# Altium schematic sheet РД-11.04.00.SchDoc: Плата освещения
size 594 x 420 mm; ApprovedBy: Иванов; CheckedBy: Вакулин; DrawnBy: Подлесный; DocumentNumber: РД-11.04.00 Э3; SheetNumber: 1; SheetTotal: 1; Format: A2; DocumentType: Схема электрическая принципиальная; Title1str: LED передняя; ImagePath: РД-11.00.00
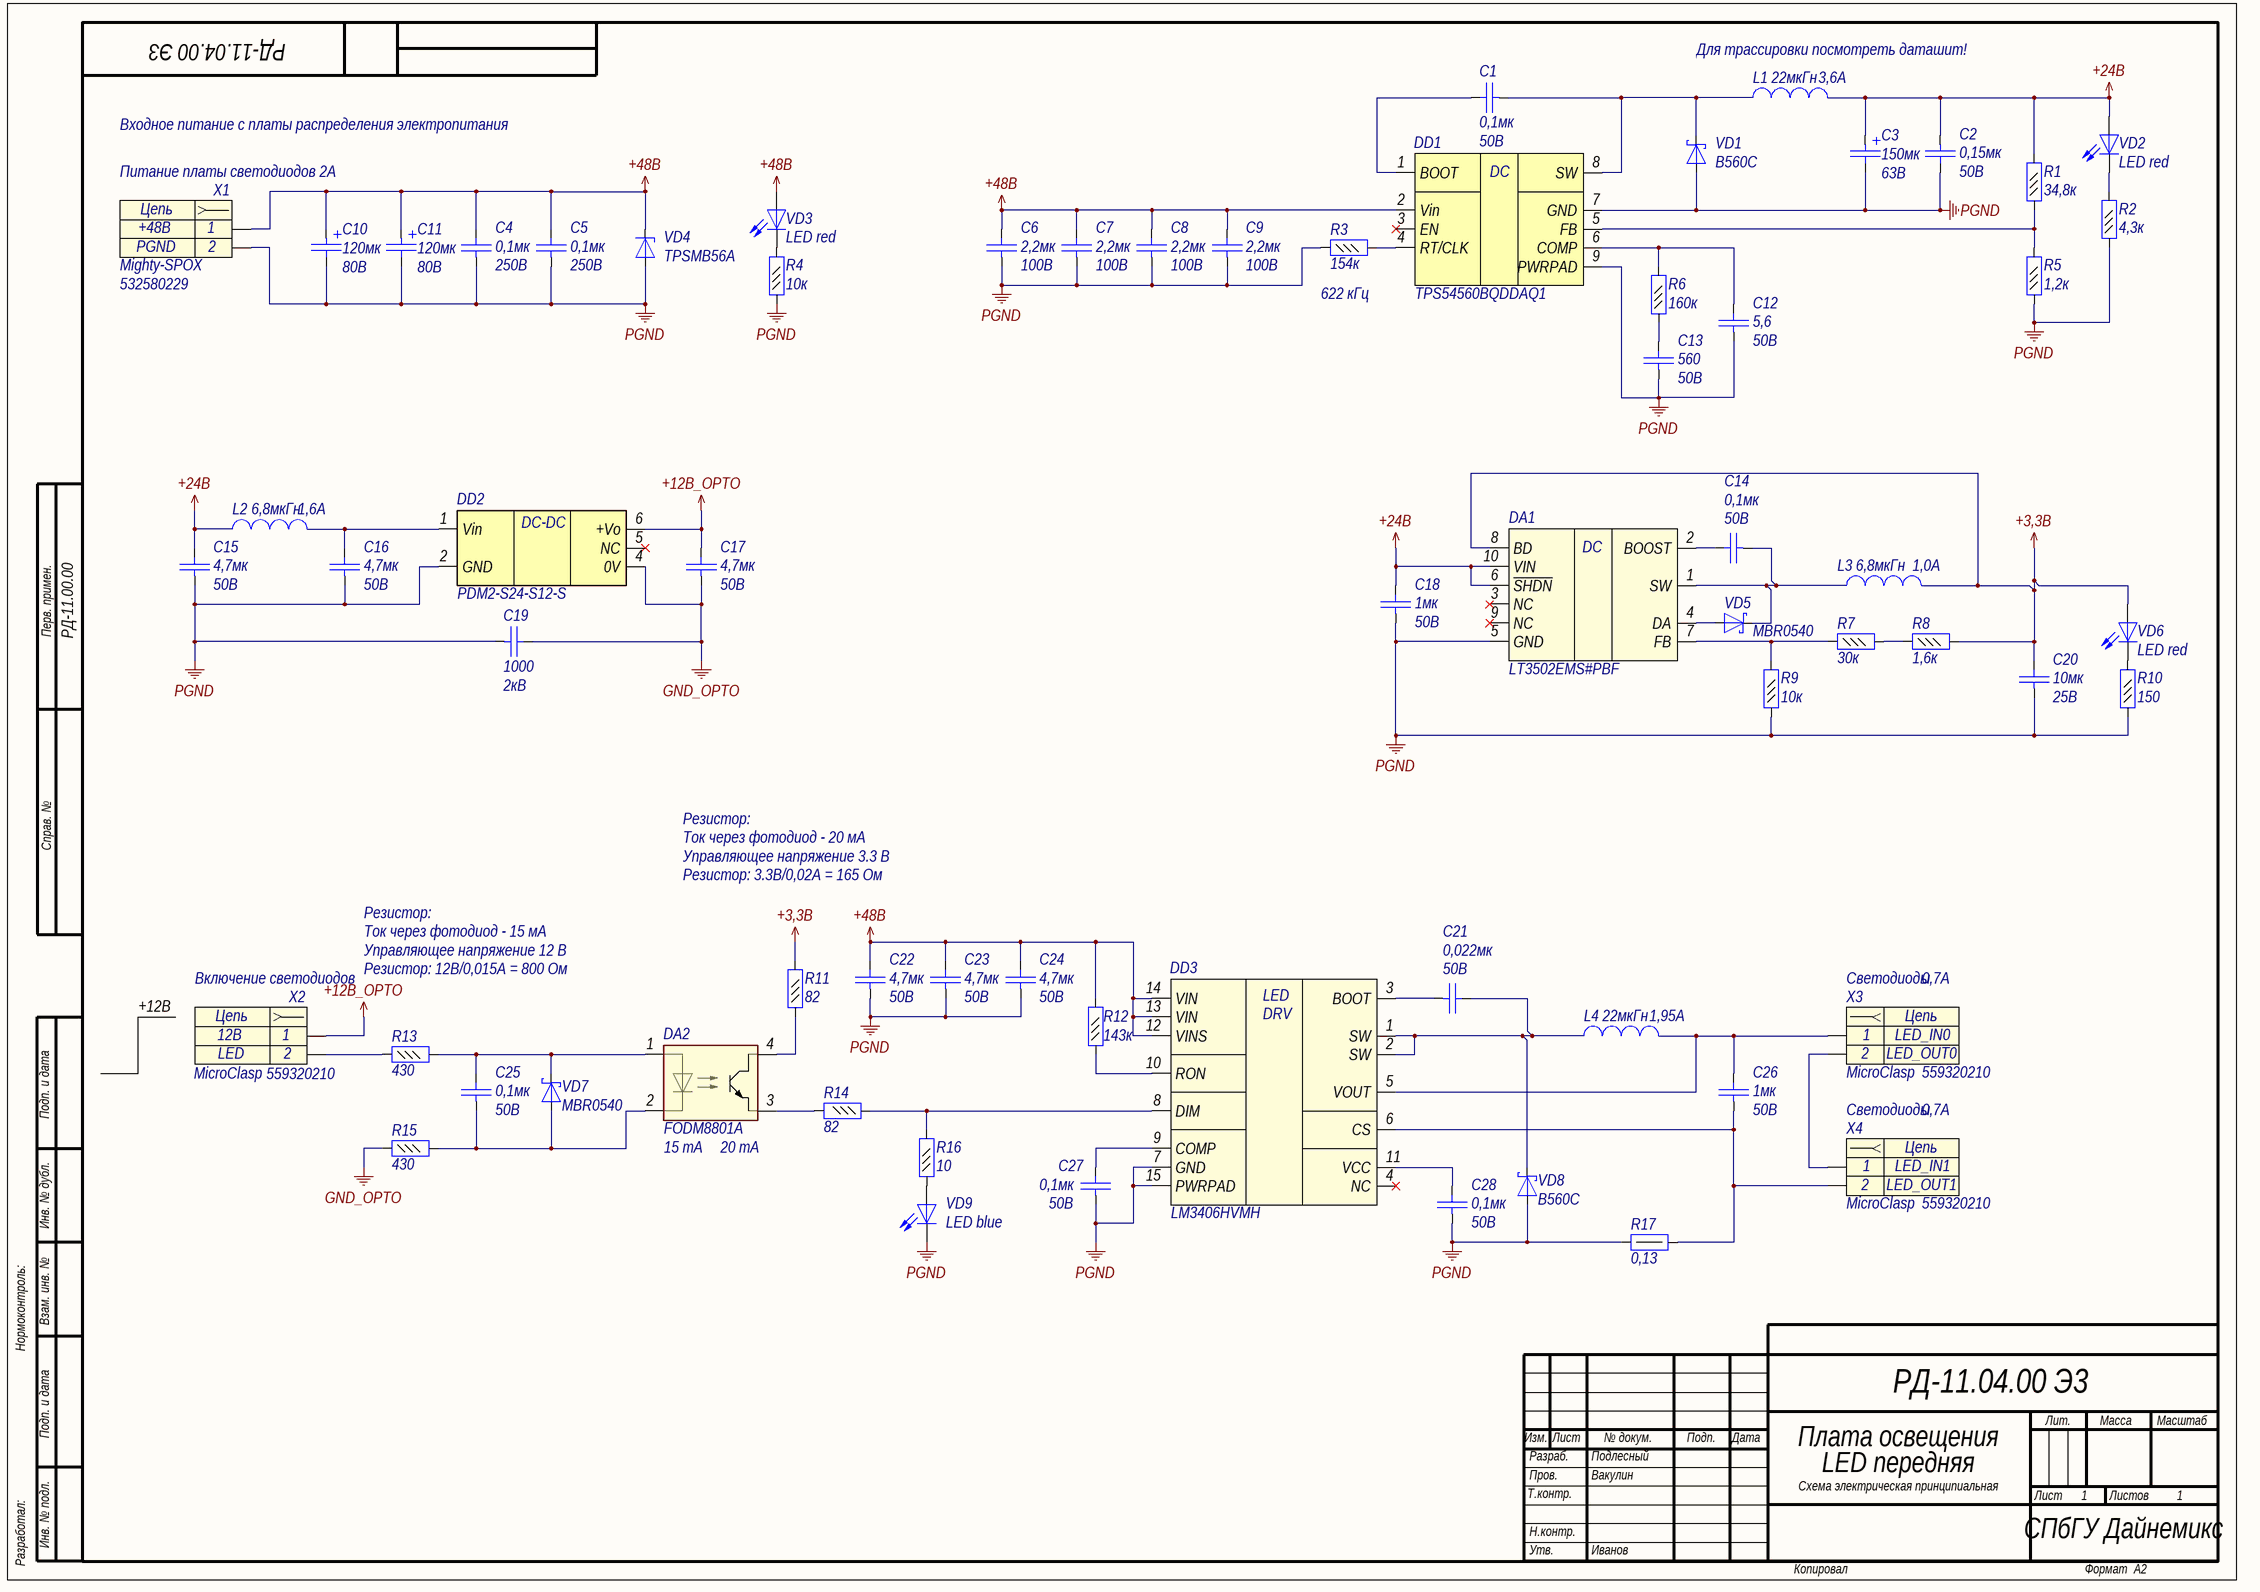
[diagram p0: РД-11.04.00.SchDoc]

## Parts
C1  Voltage: 50B  [C0603]  (hidden comment: 0,1мк)
C2  Voltage: 50В  [C1812]  (hidden comment: 0,15мк)
C3  value 150мк  Voltage: 63B  [Cap_SMD_radial_polar(10x16.5)]  (hidden comment: Capacitor_pol)
C4  value 0,1мк  Voltage: 250В  [C1206]  (hidden comment: Capacitor)
C5  value 0,1мк  Voltage: 250В  [C1206]  (hidden comment: Capacitor)
C6  Voltage: 100В  [C1812]  (hidden comment: 2,2мк)
C7  Voltage: 100В  [C1812]  (hidden comment: 2,2мк)
C8  Voltage: 100В  [C1812]  (hidden comment: 2,2мк)
C9  Voltage: 100В  [C1812]  (hidden comment: 2,2мк)
C10  value 120мк  Voltage: 80В  [K50-35(8X20)_H]  (hidden comment: Capacitor_pol)
C11  value 120мк  Voltage: 80В  [K50-35(8X20)_H]  (hidden comment: Capacitor_pol)
C12  Voltage: 50B  [C0603]  (hidden comment: 5,6)
C13  Voltage: 50B  [C0603]  (hidden comment: 560)
C14  Voltage: 50B  [C0603]  (hidden comment: 0,1мк)
C15  Voltage: 50В  [C1206]  (hidden comment: 4,7мк)
C16  Voltage: 50В  [C1206]  (hidden comment: 4,7мк)
C17  Voltage: 50В  [C1206]  (hidden comment: 4,7мк)
C18  value 1мк  Voltage: 50B  [C0805]  (hidden comment: Capacitor)
C19  Voltage: 2кB  [C1808]  (hidden comment: 1000)
C20  value 10мк  Voltage: 25В  [C1206]  (hidden comment: Capacitor)
C21  Voltage: 50B  [C0603]  (hidden comment: 0,022мк)
C22  Voltage: 50В  [C1206]  (hidden comment: 4,7мк)
C23  Voltage: 50В  [C1206]  (hidden comment: 4,7мк)
C24  Voltage: 50В  [C1206]  (hidden comment: 4,7мк)
C25  Voltage: 50B  [C0603]  (hidden comment: 0,1мк)
C26  value 1мк  Voltage: 50B  [C0805]  (hidden comment: Capacitor)
C27  Voltage: 50B  [C0603]  (hidden comment: 0,1мк)
C28  Voltage: 50B  [C0603]  (hidden comment: 0,1мк)
DA1  Part Number: LT3502EMS#PBF  [MSOP10]  (hidden comment: LT3502_MS)
DA2  Part Number: FODM8801A  [Miniflat4]  (hidden comment: OPTO-1)
DD1  Part Number: TPS54560BQDDAQ1  [SO Powerpad8]  (hidden comment: TPS54560)
DD2  Part Number: PDM2-S24-S12-S  [SIP6]  (hidden comment: PDM2-Sxx-Sxx-S)
DD3  Part Number: LM3406HVMH  [TSSOP14 POWERPAD]  (hidden comment: LM3406)
L1  value 22мкГн  Rated Current: 3,6A  [IND_12.5x12.5]  (hidden comment: Inductor)
L2  value 6,8мкГн  Rated Current: 1,6A  [SDR0604]  (hidden comment: Inductor)
L3  value 6,8мкГн  Rated Current: 1,0A  [SDR0302]  (hidden comment: Inductor)
L4  value 22мкГн  Rated Current: 1,95A  [SDR1006]  (hidden comment: Inductor)
R1  value 34,8к  [R0603]  (hidden comment: Resistor_0,062Вт)
R2  value 4,3к  [R0603]  (hidden comment: Resistor_0,062Вт)
R3  value 154к  [R0603]  (hidden comment: Resistor_0,062Вт)
R4  value 10к  [R0603]  (hidden comment: Resistor_0,062Вт)
R5  value 1,2к  [R0603]  (hidden comment: Resistor_0,062Вт)
R6  value 160к  [R0603]  (hidden comment: Resistor_0,062Вт)
R7  value 30к  [R0603]  (hidden comment: Resistor_0,062Вт)
R8  value 1,6к  [R0603]  (hidden comment: Resistor_0,062Вт)
R9  value 10к  [R0603]  (hidden comment: Resistor_0,062Вт)
R10  value 150  [R0603]  (hidden comment: Resistor_0,062Вт)
R11  value 82  [R0603]  (hidden comment: Resistor_0,062Вт)
R12  value 143к  [R0603]  (hidden comment: Resistor_0,062Вт)
R13  value 430  [R0603]  (hidden comment: Resistor_0,062Вт)
R14  value 82  [R0603]  (hidden comment: Resistor_0,062Вт)
R15  value 430  [R0603]  (hidden comment: Resistor_0,062Вт)
R16  value 10  [R0603]  (hidden comment: Resistor_0,062Вт)
R17  value 0,13  [R2010]  (hidden comment: Resistor_0,5Вт)
VD1  Part Number: B560C  [SMC]  (hidden comment: DiodeSchottky)
VD2  Part Name: LED red  [L_0603_RED]  (hidden comment: LED)
VD3  Part Name: LED red  [L_0603_RED]  (hidden comment: LED)
VD4  Part Number: TPSMB56A  [SMB]  (hidden comment: DiodeZener)
VD5  Part Number: MBR0540  [SOD-123]  (hidden comment: DiodeSchottky)
VD6  Part Name: LED red  [L_0603_RED]  (hidden comment: LED)
VD7  Part Number: MBR0540  [SOD-123]  (hidden comment: DiodeSchottky)
VD8  Part Number: B560C  [SMC]  (hidden comment: DiodeSchottky)
VD9  Part Name: LED blue  [L_0603_BLUE]  (hidden comment: LED)
X1  Питание платы светодиодов 2А  Part Name: Mighty-SPOX  Part Number: 532580229  [MOLEX_532580229]
X2  Включение светодиодов  Part Name: MicroClasp  Part Number: 559320210  [MOLEX_559320210]
X3  Cветодиоды  Part Name: MicroClasp  Part Number: 559320210  [MOLEX_559320210]
X4  Cветодиоды  Part Name: MicroClasp  Part Number: 559320210  [MOLEX_559320210]

## Nets
+3,3B: C20.2 DA1.8(BD) L3.2 R8.2 R11.2 VD6.2(A)
+12B_OPTO: C17.2 DD2.6(+Vo) X2.1
+24B: C2.1 C3.1 C15.2 C18.2 DA1.6(~{SHDN}) DA1.10(VIN) L1.2 L2.1 R1.2 VD2.2(A)
+48B: C4.2 C5.2 C6.2 C7.2 C8.2 C9.2 C10.1 C11.1 C22.2 C23.2 C24.2 DD1.2(Vin) DD3.12(VINS) DD3.13(VIN) DD3.14(VIN) R12.2 VD3.2(A) VD4.1(K) X1.1
GND_OPTO: C17.1 C19.2 DD2.4(0V) R15.1
PGND: C2.2 C3.2 C4.1 C5.1 C6.1 C7.1 C8.1 C9.1 C10.2 C11.2 C12.1 C13.1 C15.1 C16.1 C18.1 C19.1 C20.1 C22.1 C23.1 C24.1 C27.1 C28.1 DA1.5(GND) DD1.7(GND) DD1.9(PWRPAD) DD2.2(GND) DD3.7(GND) DD3.15(PWRPAD) R2.1 R3.1 R4.1 R5.1 R9.1 R10.1 R17.1 VD1.2(A) VD4.2(A) VD8.2(A) VD9.1(K) X1.2
NetC1_1: C1.1 DD1.8(SW) L1.1 VD1.1(K)
NetC1_2: C1.2 DD1.1(BOOT)
NetC12_2: C12.2 DD1.6(COMP) R6.2
NetC13_2: C13.2 R6.1
NetC14_1: C14.1 DA1.1(SW) L3.1 VD5.1(K)
NetC14_2: C14.2 DA1.2(BOOST)
NetC16_2: C16.2 DD2.1(Vin) L2.2
NetC21_1: C21.1 DD3.3(BOOT)
NetC21_2: C21.2 DD3.1(SW) DD3.2(SW) L4.1 VD8.1(K)
NetC25_1: C25.1 DA2.2 R15.2 VD7.2(A)
NetC25_2: C25.2 DA2.1 R13.2 VD7.1(K)
NetC26_1: C26.1 DD3.6(CS) R17.2 X4.2
NetC26_2: C26.2 DD3.5(VOUT) L4.2 X3.1
NetC27_2: C27.2 DD3.9(COMP)
NetC28_2: C28.2 DD3.11(VCC)
NetDA1_4: DA1.4(DA) VD5.2(A)
NetDA1_7: DA1.7(FB) R7.1 R9.2
NetDA2_3: DA2.3 R14.2
NetDA2_4: DA2.4 R11.1
NetDD1_4: DD1.4(RT/CLK) R3.2
NetDD1_5: DD1.5(FB) R1.1 R5.2
NetDD3_8: DD3.8(DIM) R14.1 R16.2
NetDD3_10: DD3.10(RON) R12.1
NetR2_2: R2.2 VD2.1(K)
NetR4_2: R4.2 VD3.1(K)
NetR7_2: R7.2 R8.1
NetR10_2: R10.2 VD6.1(K)
NetR13_1: R13.1 X2.2
NetR16_1: R16.1 VD9.2(A)
NetX3_2: X3.2 X4.1

Not connected (* = marked no-connect by the designer): DA1 3(NC)* 9(NC)*; DD1 3(EN)*; DD2 5(NC)*; DD3 4(NC)*

## Notes on the sheet
- (near L1) Для трассировки посмотреть даташит!
- Входное питание с платы распределения электропитания
- 622 кГц
- Перв. примен.
- Справ. №
- Резистор:
- Ток через фотодиод - 20 мА
- Управляющее напряжение 3.3 В
- Резистор: 3.3В/0,02А = 165 Ом
- Ток через фотодиод - 15 мА
- Управляющее напряжение 12 В
- Резистор: 12В/0,015А = 800 Ом
- +12B
- 0,7А
- Подп. и дата
- (near DA2) 15 mA
- (near DA2) 20 mA
- Инв. № дубл.
- Нормоконтроль:
- Взам. инв. №
- Изм.
- Лист
- № докум.
- Подп.
- Дата
- Лит.
- Масса
- Масштаб
- Т.контр.
- Пров.
- Разраб.
- Листов
- Разработал:
- Инв. № подл.
- Н.контр.
- СПбГУ Дайнемикс
- Утв.
- Копировал
- Формат
- (in symbol connect95) Цепь
- (in symbol connect105) Цепь
- (in symbol driver30) LED; DRV
- (in symbol pwr112) DC
- (in symbol pwr127) DC
- (in symbol pwr128) DC-DC

## Library data of the parts
C1 C14 C25 C27 C28 = cap131: Конденсатор; Part Name: Ceramic; Manufacture: Murata; Part Number: GRM188R71H104KA93D; id: cap131; TKE: X7R; Value: 0,1мк
C2 = cap285: Конденсатор; Part Name: Ceramic; Manufacture: TDK; Part Number: C4532C0G1H154J250KA; id: cap285; TKE: NP0; Value: 0,15мк
C3 = cap296: Конденсатор полярный; Part Name: Electrolit Polimer; Manufacture: Panasonic; Part Number: EEH-ZS1J151P; id: cap296; tga: 0,20%; ESR: 15мОм; Iac rated: 3,5А
C4 C5 = cap179: Конденсатор; Part Name: Ceramic; Manufacture: Murata; Part Number: GRM31CR72E104K; id: cap179; TKE: X7R
C6-C9 = cap293: Конденсатор; Part Name: MLCC; Manufacture: TDK; Part Number: C4532X7R2A225M; id: cap293; TKE: X7R; tga: 0,10%; Value: 2,2мк
C10 C11 = cap311: Конденсатор полярный; Part Name: Electrolit; Manufacture: Panasonic; Part Number: EEU-FS1K121LB; id: cap311; tga: 0.08; Zmax: 0,096Ом; Ripple current: 0,81A
C12 = cap69: Конденсатор; Part Name: Ceramic; Manufacture: Murata; Part Number: GRM1885C1H5R6C*; id: cap69; TKE: NP0; Value: 5,6
C13 = cap102: Конденсатор; Part Name: Ceramic; Manufacture: Murata; Part Number: GRM1885C1H561J; id: cap102; TKE: NP0; Value: 560
C15-C17 C22-C24 = cap188: Конденсатор; Part Name: Ceramic; Manufacture: Murata; Part Number: GRM31CR71H475KA12L; id: cap188; TKE: X7R; Value: 4,7мк
C18 C26 = cap151: Конденсатор; Part Name: Ceramic; Manufacture: Murata; Part Number: GRM21BR71H105K; id: cap151; TKE: X7R
C19 = cap266: Конденсатор; Part Name: Ceramic; Manufacture: Murata; Part Number: GR442QR73D102KW01L; id: cap266; TKE: X7R; tga: 0,10%; Value: 1000
C20 = cap186: Конденсатор; Part Name: Ceramic; Manufacture: Murata; Part Number: GRM31CR71E106KA12L*; id: cap186; TKE: X7R
C21 = cap127: Конденсатор; Part Name: Ceramic; Manufacture: Murata; Part Number: GRM188R71H223K**; id: cap127; TKE: X7R; Value: 0,022мк
DA1 = pwr112: 1.1MHz/2.2MHz, 500mA  Step-Down Regulators; Part Name: 1-A synchronous buck DC/DC converter with ultra-low IQ; Manufacturer: Linear Technology; id: pwr112; Input Voltage: 40B; Output Voltage: Adj; Current: 0,5А; Frequency: 2,2MHz; Type: Impulse
DA2 = FODM8801A: Опторазвязка; Manufacturer: ON Semiconductor; id: opto2; Forward current: 20мА; Forward Voltage: 1,8B; Reverse voltage: 6B; Continuous collector current: 30mA; Voltage coll-emmiter: 75B; Max tempreture: +125; Min tempreture: -40; Power dissipation: 300mW
DD1 = pwr127: 5-A, Wide Input Range, Step-Down Converter; Part Name: Step Down DC-DC Converter with Eco-mode; Manufacturer: Texas Instruments; id: pwr127; Input Voltage: 4,5-60В; Output Voltage: 0,8B-58,8B; Current: 5A; Frequency: 100 kHz-25 MHz; Type: Impulse
DD2 = pwr128: DC/DC преобразователь изолированный; Part Name: DC/DC Converter Isolated; Manufacturer: CUI INC; id: pwr128; Input Voltage: 24B; Output Voltage: 12B; Current: 167mA; Power output: 2W; Type: Isolated
DD3 = driver30: 1.5A Constant Current Buck Regulator for Driving High  Power LEDs; Manufacture: National Semiconductor; id: driver30; Part Name: 1.5A Constant Current Buck Regulator for Driving High Power LEDs
L1 = ind79: EMI Suppression Filter; Part Name: SMD Power Inductors; Part Number: B82477G4223M000; Manufacture: Epcos; id: ind79; Saturation Current: 4,25A; Resistance: 0,038Ohm
L2 = ind40: EMI Suppression Filter; Part Name: SMD Power Inductors; Part Number: SDR0604-6R8ML; Manufacture: Bourns; id: ind40; Saturation Current: 2,5A; Resistance: 0,12Ohm
L3 = ind186: EMI Suppression Filter; Part Name: SMD Power Inductors; Part Number: SDR0302-6R8ML; Manufacture: Bourns; id: ind186; Saturation Current: 1,2A; Resistance: 0,18Ohm; q-factor: 18; Temp MAX: 125; Temp MIN: -40
L4 = ind103: EMI Suppression Filter; Part Name: SMD Power Inductors; Part Number: SDR1006- 220ML; Manufacture: Bourns; id: ind103; Saturation Current: 3,5A; Resistance: 0,1Ohm
R1 = res1191: Резистор; Manufacture: Yageo; Part Number: RC0603FR-0734K8L; Accuracy: 0,01; id: res1191; Part Name: Resistor; Power: 0,062Вт
R2 = res478: Резистор; Manufacture: Yageo; Part Number: RC0603FR-074K3; id: res478; Accuracy: 0,01; Part Name: Resistor; Power: 0,062Вт
R3 = res1209: Резистор; Manufacture: Yageo; Part Number: RC0603FR-07154KL; Accuracy: 0,01; id: res1209; Part Name: Resistor; Power: 0,062Вт
R4 R9 = res487: Резистор; Manufacture: Yageo; Part Number: RC0603FR-0710KL; id: res487; Accuracy: 0,01; Part Name: Resistor; Power: 0,062Вт
R5 = res465: Резистор; Manufacture: Yageo; Part Number: RC0603FR-071K2; id: res465; Accuracy: 0,01; Part Name: Resistor; Power: 0,062Вт
R6 = res516: Резистор; Manufacture: Yageo; Part Number: RC0603FR-07160KL; id: res516; Accuracy: 0,01; Part Name: Resistor; Power: 0,062Вт
R7 = res498: Резистор; Manufacture: Yageo; Part Number: RC0603FR-0730KL; id: res498; Accuracy: 0,01; Part Name: Resistor; Power: 0,062Вт
R8 = res468: Резистор; Manufacture: Yageo; Part Number: RC0603FR-071K6; id: res468; Accuracy: 0,01; Part Name: Resistor; Power: 0,062Вт
R10 = res443: Резистор; Manufacture: Yageo; Part Number: RC0603FR-07150RL; id: res443; Accuracy: 0,01; Part Name: Resistor; Power: 0,062Вт
R11 R14 = res437: Резистор; Manufacture: Yageo; Part Number: RC0603FR-0782RL; id: res437; Accuracy: 0,01; Part Name: Resistor; Power: 0,062Вт
R12 = res1252: Резистор; Manufacture: Yageo; Part Number: RC0603FR-07143KL; Accuracy: 0,01; id: res1252; Part Name: Resistor; Power: 0,062Вт
R13 R15 = res454: Резистор; Manufacture: Yageo; Part Number: RC0603FR-07430RL; id: res454; Accuracy: 0,01; Part Name: Resistor; Power: 0,062Вт
R16 = res415: Резистор; Manufacture: Yageo; Part Number: RC0603FR-0710RL; id: res415; Accuracy: 0,01; Part Name: Resistor; Power: 0,062Вт
R17 = res1255: Резистор; Part Name: Shunt; Manufacture: Bourns; Part Number: CRL2010-FW-R130ELF; Accuracy: 0,01; Power: 0,5Вт; id: res1255
VD1 VD8 = diode32: Диод Шоттки; Part Name: SCHOTTKY BARRIER RECTIFIER; Manufacture: Diodes Incorporated; Max Reverse Voltage: 60B; Forward Voltage: 0,7B; Forward Current: 5A; Leakage current: 20mA; Capacitance: 300pF; Number of Channels: 1; id: diode32; Breakdown Voltage: 60B; Temp MAX: +150; Temp MIN: -55
VD2 VD3 VD6 = diode41: Светодиод; Part Number: TO-1608BC-MRE; Manufacture: OASISTEK; id: diode41
VD4 = TPSMB56A: Cтабилитрон (лавинный выпрямительный диод) односторонний; Part Name: TVS diode Unidirectional; Manufacture: Littelfuse; id: tvs285; Leakage Current: 8uA; Stand-off Voltage: 56B; Breakdown Voltage: 58,8B; Clamping voltage: 77B; Peak Pulse Power: 600W; Number of diodes: 1
VD5 VD7 = diode15: Диод Шоттки; Manufacture: ON Semiconductor; Max Reverse Voltage: 40B; Forward Voltage: 0,62B; Forward Current: 0,5А; Capacitance: 30pF; Number of Channels: 1; id: diode15; Part Name: Diode Schottky
VD9 = diode42: Светодиод; Part Number: TO-1608BC-BF; Manufacture: OASISTEK; id: diode42
X1 = connect105: Разъем - 2 конт. розетка; Manufacture: Molex; Contact_1: +48B; Contact_2: PGND; Etch: 3.5mm; id: connect105
X2 = connect95: Разъем - 2 конт. розетка; Manufacture: Molex; Contact_1: 12B; Contact_2: LED; Etch: 2mm; id: connect95
X3 = connect95: Разъем - 2 конт. розетка; Manufacture: Molex; Contact_1: LED_IN0; Contact_2: LED_OUT0; Etch: 2mm; id: connect95
X4 = connect95: Разъем - 2 конт. розетка; Manufacture: Molex; Contact_1: LED_IN1; Contact_2: LED_OUT1; Etch: 2mm; id: connect95